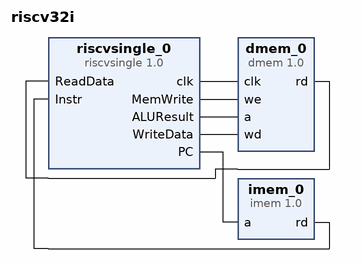
[diagram p0: block diagram of the top level]
# Vivado block design riscv32i, xc7z010clg400-1, Vivado 2019.2
create_bd_design riscv32i

create_bd_cell -type ip -vlnv ManuelRodriguez.org:user:riscvsingle:1.0 riscvsingle_0
create_bd_cell -type ip -vlnv ManuelRodriguez.org:user:dmem:1.0 dmem_0
create_bd_cell -type ip -vlnv ManuelRodriguez.org:user:imem:1.0 imem_0

# ---- connections ----

connect_bd_net [get_bd_pins riscvsingle_0/clk] [get_bd_pins dmem_0/clk]
connect_bd_net [get_bd_pins riscvsingle_0/MemWrite] [get_bd_pins dmem_0/we]
connect_bd_net [get_bd_pins riscvsingle_0/ALUResult] [get_bd_pins dmem_0/a]
connect_bd_net [get_bd_pins riscvsingle_0/WriteData] [get_bd_pins dmem_0/wd]
connect_bd_net [get_bd_pins dmem_0/rd] [get_bd_pins riscvsingle_0/ReadData]
connect_bd_net [get_bd_pins riscvsingle_0/PC] [get_bd_pins imem_0/a]
connect_bd_net [get_bd_pins imem_0/rd] [get_bd_pins riscvsingle_0/Instr]

validate_bd_design
save_bd_design
